# Altium schematic sheet Controllable_voltage_outputs.SchDoc
size A4; SheetNumber: 3; SheetTotal: 10
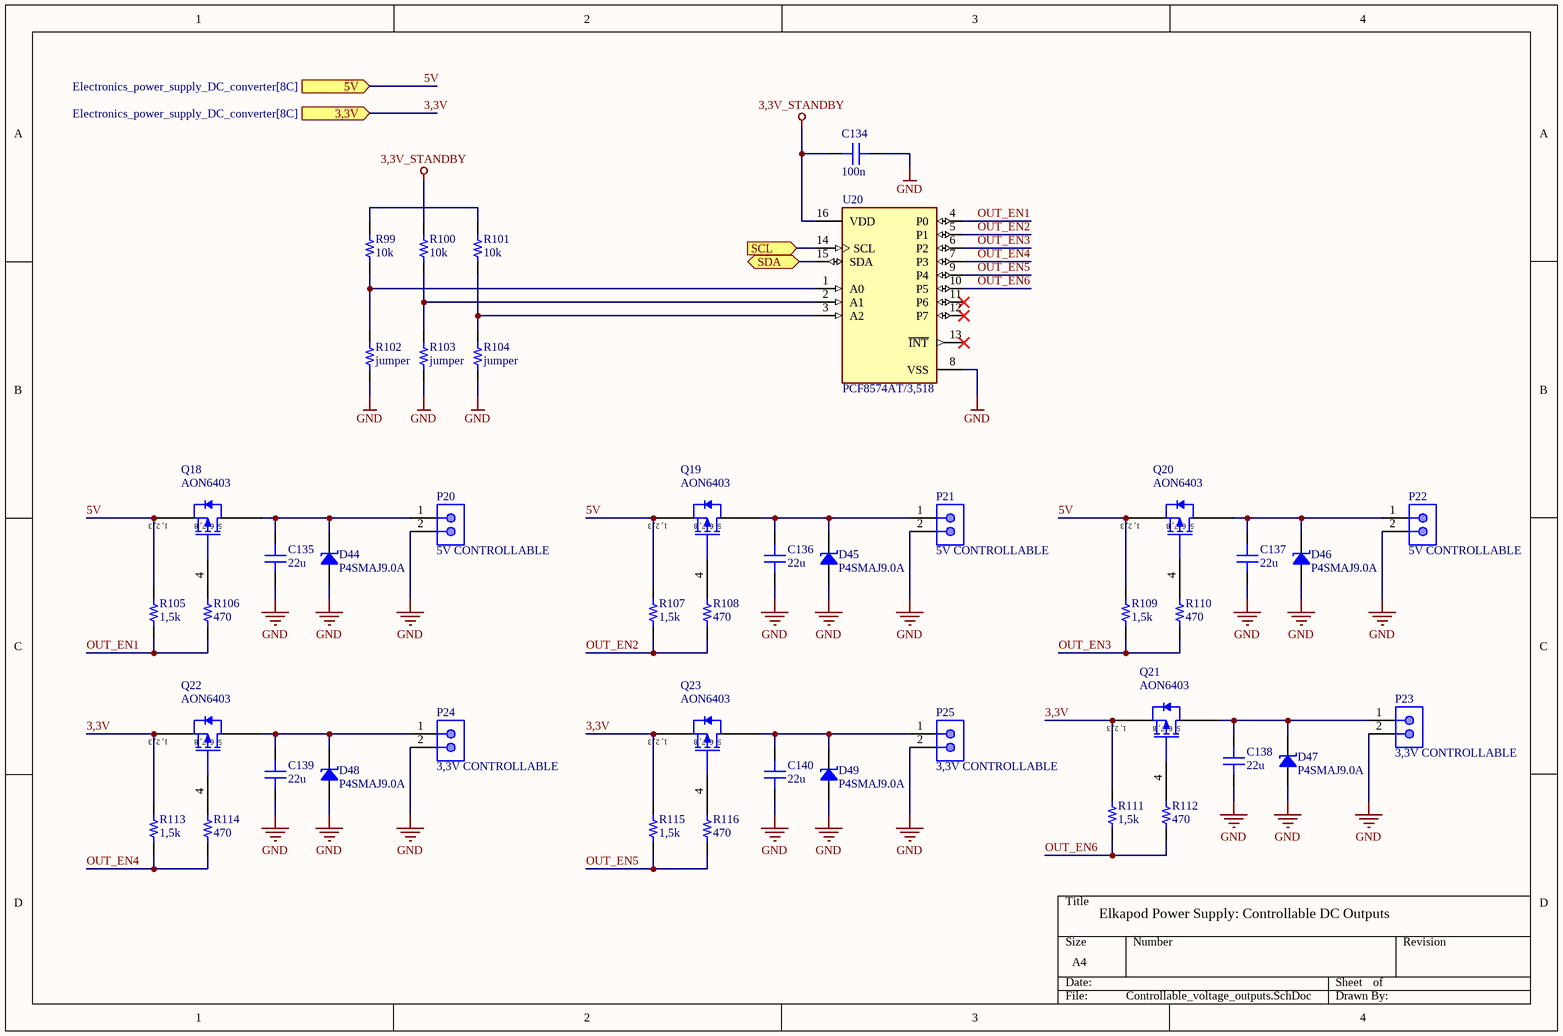
[diagram p0: Controllable_voltage_outputs.SchDoc]

## Parts
C134  100n  [CAP 0603_1608]
C135  22u  [CAP 0805_2012]
C136  22u  [CAP 0805_2012]
C137  22u  [CAP 0805_2012]
C138  22u  [CAP 0805_2012]
C139  22u  [CAP 0805_2012]
C140  22u  [CAP 0805_2012]
D44  P4SMAJ9.0A  [DO214AC SMA]
D45  P4SMAJ9.0A  [DO214AC SMA]
D46  P4SMAJ9.0A  [DO214AC SMA]
D47  P4SMAJ9.0A  [DO214AC SMA]
D48  P4SMAJ9.0A  [DO214AC SMA]
D49  P4SMAJ9.0A  [DO214AC SMA]
P20  5V CONTROLLABLE  [MOLX-22-23-2021_V]
P21  5V CONTROLLABLE  [MOLX-22-23-2021_V]
P22  5V CONTROLLABLE  [MOLX-22-23-2021_V]
P23  3,3V CONTROLLABLE  [MOLX-22-23-2021_V]
P24  3,3V CONTROLLABLE  [MOLX-22-23-2021_V]
P25  3,3V CONTROLLABLE  [MOLX-22-23-2021_V]
Q18  AON6403  [DFN5x6]
Q19  AON6403  [DFN5x6]
Q20  AON6403  [DFN5x6]
Q21  AON6403  [DFN5x6]
Q22  AON6403  [DFN5x6]
Q23  AON6403  [DFN5x6]
R99  10k  [RES 0603_1608]
R100  10k  [RES 0603_1608]
R101  10k  [RES 0603_1608]
R102  value jumper  [RES 0603_1608]  (hidden comment: A0_jumper)
R103  value jumper  [RES 0603_1608]  (hidden comment: A1_jumper)
R104  value jumper  [RES 0603_1608]  (hidden comment: A2_jumper)
R105  1,5k  [RES 0603_1608]
R106  470  [RES 0603_1608]
R107  1,5k  [RES 0603_1608]
R108  470  [RES 0603_1608]
R109  1,5k  [RES 0603_1608]
R110  470  [RES 0603_1608]
R111  1,5k  [RES 0603_1608]
R112  470  [RES 0603_1608]
R113  1,5k  [RES 0603_1608]
R114  470  [RES 0603_1608]
R115  1,5k  [RES 0603_1608]
R116  470  [RES 0603_1608]
U20  PCF8574AT/3,518  [FP-SOT162-1-MFG]

## Ports
3,3V (in, see Electronics_power_supply_DC_converter[8C]), 5V (in, see Electronics_power_supply_DC_converter[8C]), SCL (in, see Electronics_power_supply_DC_converter[8C], Electronics_power_supply_DC_converter[7C], Logic_controller[1D], Servos_controller[1C], Servos_DC_converter[5A]), SDA (bidir, see Electronics_power_supply_DC_converter[8C], Electronics_power_supply_DC_converter[7C], Logic_controller[1D], Servos_controller[1C], Servos_DC_converter[5A])

## Nets
3,3V_STANDBY: C134.2 R100.1 U20.16(VDD)
GND: C134.1 C135.1 C136.1 C137.1 C138.1 C139.1 C140.1 D44.1 D45.1 D46.1 D47.1 D48.1 D49.1 P20.2 P21.2 P22.2 P23.2 P24.2 P25.2 R102.2 R103.2 R104.2 U20.8(VSS)
3,3V: Q21.1(S) Q21.2(S) Q21.3(S) Q22.1(S) Q22.2(S) Q22.3(S) Q23.1(S) Q23.2(S) Q23.3(S) R111.1 R113.1 R115.1 ; port 3,3V
5V: Q18.1(S) Q18.2(S) Q18.3(S) Q19.1(S) Q19.2(S) Q19.3(S) Q20.1(S) Q20.2(S) Q20.3(S) R105.1 R107.1 R109.1 ; port 5V
OUT_EN1: R105.2 R106.2 U20.4(P0)
OUT_EN2: R107.2 R108.2 U20.5(P1)
OUT_EN3: R109.2 R110.2 U20.6(P2)
OUT_EN4: R113.2 R114.2 U20.7(P3)
OUT_EN5: R115.2 R116.2 U20.9(P4)
OUT_EN6: R111.2 R112.2 U20.10(P5)
SCL: U20.14(SCL) ; port SCL
SDA: U20.15(SDA) ; port SDA
NetC135_2: C135.2 D44.2 P20.1 Q18.5-6-7-8(D)
NetC136_2: C136.2 D45.2 P21.1 Q19.5-6-7-8(D)
NetC137_2: C137.2 D46.2 P22.1 Q20.5-6-7-8(D)
NetC138_2: C138.2 D47.2 P23.1 Q21.5-6-7-8(D)
NetC139_2: C139.2 D48.2 P24.1 Q22.5-6-7-8(D)
NetC140_2: C140.2 D49.2 P25.1 Q23.5-6-7-8(D)
NetQ18_4: Q18.4(G) R106.1
NetQ19_4: Q19.4(G) R108.1
NetQ20_4: Q20.4(G) R110.1
NetQ21_4: Q21.4(G) R112.1
NetQ22_4: Q22.4(G) R114.1
NetQ23_4: Q23.4(G) R116.1
NetR99_1: R99.1 R101.1
NetR99_2: R99.2 R102.1 U20.1(A0)
NetR100_2: R100.2 R103.1 U20.2(A1)
NetR101_2: R101.2 R104.1 U20.3(A2)

Not connected (* = marked no-connect by the designer): U20 11(P6)* 12(P7)* 13(~{INT})*

## Notes on the sheet
- Elkapod Power Supply: Controllable DC Outputs
- (in symbol AON6403) 1, 2, 3; 5, 6, 7, 8

## Library data of the parts
C134 = C0603C272F3GAC7867: CAP CER 100nF 25V X5R 0603; manufacturer: KEMET; Temperature Coefficient: C0G, NP0; Tolerance: ±1%; Part Number: C0603C272F3GAC7867; Value: 100n; Applications: General Purpose; Capacitance: 100n; componentlink1description: Datasheet; componentlink1url: https://api.kemet.com/component-edge/download/datasheet/C0603C272F3GACTU.pdf; componentlink2description: DigiKey Link; componentlink2url: https://www.digikey.com/en/products/detail/kemet/C0603C272F3GAC7867/2200413; Device Package: 0603 (1608 Metric); Features: Low ESL; lastupdated: 09.02.2024 20:10:30; Lifecycle Status: Active; Minimum Order: 1; Mounting Type: Surface Mount, MLCC; Operating Temperature: -55°C ~ 125°C; Package / Case: 0603 (1608 Metric); packaging: TapeAndReel; partid: 2138; Part Status: Active; price: 0.40; series: SMD Comm C0G; Size / Dimension: 0.063" L x 0.031" W (1.60mm x 0.80mm); Thickness (Max): 0.034" (0.87mm); Voltage - Rated: 25V
C135-C140 = VJ0805Y684KXQTW1BC: CAP CER 22UF 25V X7R 0805; manufacturer: Vishay Vitramon; Tolerance: ±10%; Voltage - Rated: 10V; Part Number: VJ0805Y684KXQTW1BC; Value: 22u; Applications: General Purpose; Capacitance: 22u; componentlink1description: Datasheet; componentlink1url: https://www.vishay.com/docs/28548/vjw1bcbascomseries.pdf; componentlink2description: DigiKey Link; componentlink2url: https://www.digikey.com/en/products/detail/vishay-vitramon/VJ0805Y684KXQTW1BC/8313569; Device Package: 0805 (2012 Metric); lastupdated: 09.02.2024 20:13:13; Lifecycle Status: Active; Minimum Order: 1; Mounting Type: Surface Mount, MLCC; Operating Temperature: -55°C ~ 125°C; Package / Case: 0805 (2012 Metric); packaging: TapeAndReel; partid: 57262; price: 0.05; series: VJ W1BC; Size / Dimension: 0.079" L x 0.049" W (2.00mm x 1.25mm); Temperature Coefficient: X7R; Thickness (Max): 0.053" (1.35mm)
D44-D49 = SMA6J18A-TP: TVS DIODE 9VDC DO214AC; Part Number: P4SMAJ9.0A
P20-P25 = CMP-1704-00001-3: Male Header, Pitch 2.54 mm, 1 x 2 Position, Height 10.67 mm, Tail Length 3.56 mm, 0 to 75 degC, RoHS, Bulk; Package Quantity: 3000; Height: 10.67 mm; RoHSCompliant: True; ComponentLink2URL: https://datasheet.ciiva.com/19454/232266-19454304.pdf; PartNumber: 22-23-2021; Packaging: Bulk; ComponentLink2Description: Datasheet; Min Operating Temperature: 0 degC; ComponentLink1Description: Manufacturer URL; Length: 5.08 mm; Mounting Technology: Through Hole; Max Operating Temperature: 75 degC; REACH SVHC: Unknown; PackageDescription: Male Header, Pitch 2.54 mm, 1 x 2 Position, Height 10.67 mm, Tail Length 3.56 mm; ComponentLink1URL: http://www.molex.com/; Mount: Through Hole; Radiation Hardening: No; Width: 6.35 mm; Pins: 2
Q18-Q23 = AON6403: P-MOSFET; 67A; 30V; DFN5x6
R99-R101 = RNCS0603BKE10K0: RES 10K OHM 1% 0,1W 0603; Manufacturer: Stackpole Electronics Inc; Power (Watts): 0.063W, 1/16W; Temperature Coefficient: ±25ppm/°C; Tolerance: ±0.1%; Part Number: RNCS0603BKE10K0; Value: 10k; Composition: Thin Film; Device Package: 0603 (1608 Metric); Features: Anti-Corrosive, Automotive AEC-Q200, Moisture Resistant; Height - Seated (Max): 0.022" (0.55mm); LastUpdated: 09.02.2024 20:43:37; Lifecycle Status: Active; Minimum Order: 1; Number of Terminations: 2; Operating Temperature: -55°C ~ 155°C; Package / Case: 0603 (1608 Metric); Packaging: TapeAndReel; PartId: 4838; Part Status: Active; Price: 0.06; Ratings: AEC-Q200; Resistance: 10k; Series: RNCS; Size / Dimension: 0.061" L x 0.031" W (1.55mm x 0.80mm); Supplier Device Package: 0603
R102-R104 = RNCS0603BKE10K0: RES 0 OHM 1% 0,1W 0603; Manufacturer: Stackpole Electronics Inc; Power (Watts): 0.063W, 1/16W; Resistance: 0; Temperature Coefficient: ±25ppm/°C; Tolerance: ±0.1%; Part Number: RNCS0603BKE10K0; Composition: Thin Film; Device Package: 0603 (1608 Metric); Features: Anti-Corrosive, Automotive AEC-Q200, Moisture Resistant; Height - Seated (Max): 0.022" (0.55mm); LastUpdated: 09.02.2024 20:43:37; Lifecycle Status: Active; Minimum Order: 1; Number of Terminations: 2; Operating Temperature: -55°C ~ 155°C; Package / Case: 0603 (1608 Metric); Packaging: TapeAndReel; PartId: 4838; Part Status: Active; Price: 0.06; Ratings: AEC-Q200; Series: RNCS; Size / Dimension: 0.061" L x 0.031" W (1.55mm x 0.80mm); Supplier Device Package: 0603
R105 R107 R109 R111 R113 R115 = RNCS0603BKE10K0: RES 1,5K OHM 1% 0,1W 0603; Manufacturer: Stackpole Electronics Inc; Power (Watts): 0.063W, 1/16W; Temperature Coefficient: ±25ppm/°C; Tolerance: ±0.1%; Part Number: RNCS0603BKE10K0; Value: 1,5k; Composition: Thin Film; Device Package: 0603 (1608 Metric); Features: Anti-Corrosive, Automotive AEC-Q200, Moisture Resistant; Height - Seated (Max): 0.022" (0.55mm); LastUpdated: 09.02.2024 20:43:37; Lifecycle Status: Active; Minimum Order: 1; Number of Terminations: 2; Operating Temperature: -55°C ~ 155°C; Package / Case: 0603 (1608 Metric); Packaging: TapeAndReel; PartId: 4838; Part Status: Active; Price: 0.06; Ratings: AEC-Q200; Resistance: 1,5k; Series: RNCS; Size / Dimension: 0.061" L x 0.031" W (1.55mm x 0.80mm); Supplier Device Package: 0603
R106 R108 R110 R112 R114 R116 = RNCS0603BKE10K0: RES 470 OHM 1% 0,1W 0603; Manufacturer: Stackpole Electronics Inc; Power (Watts): 0.063W, 1/16W; Temperature Coefficient: ±25ppm/°C; Tolerance: ±0.1%; Part Number: RNCS0603BKE10K0; Value: 470; Composition: Thin Film; Device Package: 0603 (1608 Metric); Features: Anti-Corrosive, Automotive AEC-Q200, Moisture Resistant; Height - Seated (Max): 0.022" (0.55mm); LastUpdated: 09.02.2024 20:43:37; Lifecycle Status: Active; Minimum Order: 1; Number of Terminations: 2; Operating Temperature: -55°C ~ 155°C; Package / Case: 0603 (1608 Metric); Packaging: TapeAndReel; PartId: 4838; Part Status: Active; Price: 0.06; Ratings: AEC-Q200; Resistance: 470; Series: RNCS; Size / Dimension: 0.061" L x 0.031" W (1.55mm x 0.80mm); Supplier Device Package: 0603
U20 = CMP-10112-000003-1: IC I/O EXPANDER I2C 8B 16SOIC; Manufacturer: NXP Semiconductors; Interface: I2C,SMBus; Frequency: 100kHz; Nominal Supply Current: 40uA; Max Supply Voltage: 6V; Number Of I/Os: 8; Max Junction Temp: +125°C; Min Supply Voltage: 2.5V; Standoff Height: 0.1mm; RoHS: TRUE; Category: IC; Temperature: -40°C to +85°C; Device Class L3: I/O Expanders; ComponentLink2Description: Datasheet; ComponentLink2URL: https://www.nxp.com/docs/en/data-sheet/PCF8574_PCF8574A.pdf; Digikey Description: IC I/O EXPANDER I2C 8B 16SOIC; Ipc Land Pattern Name: SOIC127P1032X265-16; Mouser Description: PCF8574 Series 2.5 to 6V Remote 8-bit I/O Expander for I2C-bus -SOIC-16; Footprint Url: https://www.nxp.com/docs/en/package-information/SOT162-1.pdf; Lead Free: Yes; Device Class L2: Interface ICs; Ambient Temperature Range Low: -40°C; Temperature Range High: +85°C; Automotive: No; Manufacturer Part Number: PCF8574AT/3,518; Ambient Temperature Range High: +85°C; Height: 2.65mm; Package: SOT162-1; Temperature Range Low: -40°C; Octopart: https://octopart.com/pcf8574at%2F3%2C518-nxp+semiconductors-11541925; Device Class L1: Integrated Circuits (ICs)